# Altium schematic sheet Communication circuit2.SchDoc
size A4
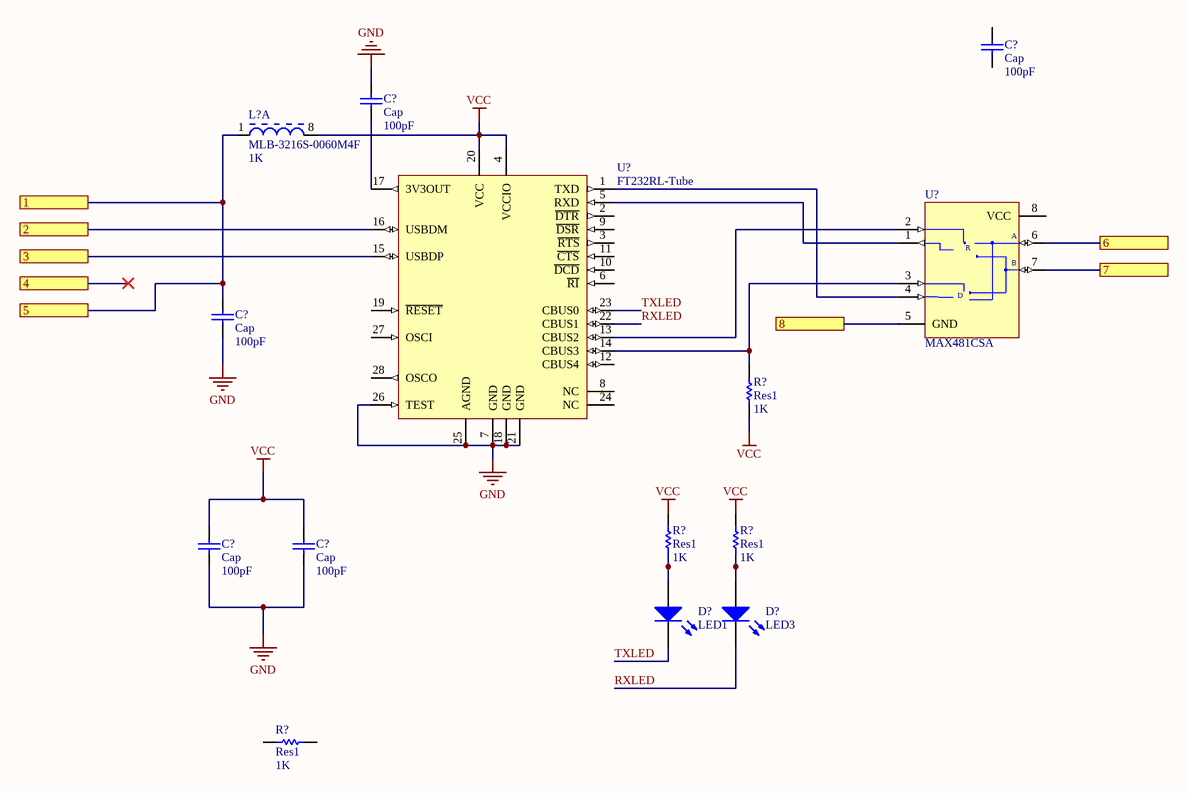
[diagram p0: Communication circuit2.SchDoc]

## Parts
(Parts that share a designator on the sheet are numbered #1, #2 ... from top to bottom, then left to right.)
C?#1  Cap  value 100pF  [RAD-0.3]
C?#2  Cap  value 100pF  [RAD-0.3]
C?#3  Cap  value 100pF  [RAD-0.3]
C?#4  Cap  value 100pF  [RAD-0.3]
C?#5  Cap  value 100pF  [RAD-0.3]
D?#1  LED1  [LED-1]
D?#2  LED3  [3.5X2.8X1.9]
L?  MLB-3216S-0060M4F  value 1K  [0805]  (part A of 4)
R?#1  Res1  value 1K  [AXIAL-0.3]
R?#2  Res1  value 1K  [AXIAL-0.3]
R?#3  Res1  value 1K  [AXIAL-0.3]
R?#4  Res1  value 1K  [AXIAL-0.3]
U?#1  FT232RL-Tube  [SSOP-28_N]
U?#2  MAX481CSA  [NSO8_N]

## Ports
1, 2, 3, 4, 5, 6, 7, 8

## Nets
GND: C?#2.2 C?#3.1 C?#4.1 C?#5.1 U?#1.7(GND) U?#1.18(GND) U?#1.21(GND) U?#1.25(AGND) U?#1.26(TEST)
VCC: C?#4.2 C?#5.2 L?.8 R?#1.2 R?#2.1 R?#3.1 U?#1.4(VCCIO) U?#1.20(VCC)
1: C?#3.2 L?.1 ; port 1, port 5
2: U?#1.16(USBDM) ; port 2
3: U?#1.15(USBDP) ; port 3
6: U?#2.6(A) ; port 6
7: U?#2.7(B) ; port 7
8: U?#2.5(GND) ; port 8
RXLED: D?#2.2(K) U?#1.22(CBUS1)
TXLED: D?#1.2(K) U?#1.23(CBUS0)
NetC?#2_1: C?#2.1 U?#1.17(3V3OUT)
NetD?#1_1: D?#1.1(A) R?#2.2
NetD?#2_1: D?#2.1(A) R?#3.2
NetR?#1_1: R?#1.1 U?#1.14(CBUS3) U?#2.3(DE)
NetU?#1_1: U?#1.1(TXD) U?#2.4(DI)
NetU?#1_5: U?#1.5(RXD) U?#2.1(RO)
NetU?#1_13: U?#1.13(CBUS2) U?#2.2(~{RE})

Not connected (* = marked no-connect by the designer): C?#1 1 2; R?#4 1 2; U?#1 2(~{DTR}) 3(~{RTS}) 6(~{RI}) 8(NC) 9(~{DSR}) 10(~{DCD}) 11(~{CTS}) 12(CBUS4) 19(~{RESET}) 24(NC) 27(OSCI) 28(OSCO); U?#2 8(VCC)

## Notes on the sheet
- (in symbol MAX481CSA) R; D

## Library data of the parts
C?#1-C?#5 = Cap: Capacitor; Published: 8-Jun-2000; LatestRevisionDate: 17-Jul-2002; LatestRevisionNote: Re-released for DXP Platform.; PackageReference: RAD-0.3; Publisher: Altium Limited; PackageDescription: Radial Cap, Thru-Hole; 2 Leads; 0.3 in Pin Spacing
D?#1 = LED1: Typical RED GaAs LED; Published: 8-Jun-2000; LatestRevisionDate: 08-Jul-2005; LatestRevisionNote: Mech Layer 1 removed.; PackageReference: LED-1; Publisher: Altium Limited; PackageDescription: LED; 2 Leads
D?#2 = LED3: Typical BLUE SiC LED; Published: 8-Jun-2000; LatestRevisionDate: 17-Dec-2003; LatestRevisionNote: PCB Footprint replaced.; DatasheetVersion: 16-Apr-2002; PackageVersion: 16-Apr-2002; PackageReference: 3.5X2.8X1.9; Publisher: Altium Limited; PackageDescription: SM LED; 2 C-Bend Leads; Body 3.5 x 2.8 x 1.9 mm, inc leads (LxWxH typ)
L? = MLB-3216S-0060M4F: Ferrite Bead (4x1608 = 3216) SM Chip Array, 8 Leads, 60Ohm, 300mA; PCB_Layout: Complies with manufacturer's recommendation.; Sim Note: Enter the Resistance value into parameter field.; Published: 26-Sep-2008; DatasheetVersion: Mar-2007; PackageVersion: Mar-2007; PackageReference: 321608; Publisher: Altium Limited; PackageDescription: 4-Line Ferrite Bead Chip Array, (1206); SM; 8 Leads; Body 3.2 x 1.5 x 0.8mm (LxWxH typ); ComponentLink1Description: Manufacturer Link; ComponentLink1URL: http://www.kitagawa.de/; ComponentLink2Description: Datasheet; ComponentLink2URL: http://www.kitagawa.de/database/ind/in025027.pdf
R?#1-R?#4 = Res1: Resistor; Published: 8-Jun-2000; LatestRevisionDate: 17-Jul-2002; LatestRevisionNote: Re-released for DXP Platform.; PackageReference: AXIAL-0.3; Publisher: Altium Limited; PackageDescription: Axial Device, Thru-Hole; 2 Leads; 0.3 in Pin Spacing
U?#1 = FT232RL-Tube: USB UART Asynchronous Serial Data Transfer Chip, SSOP-28, Tube; Published: 19-Aug-2010; DatasheetVersion: ver 2.07, Jul-2010; PackageVersion: 2010; PackageReference: SSOP-28; Publisher: Altium Limited; PackageDescription: 28-Pin Small Outline Package 0.65 mm Pitch; ComponentLink1Description: Manufacturer Link; ComponentLink1URL: http://www.ftdichip.com/Products/ICs/FT232R.htm; ComponentLink2Description: Datasheet; ComponentLink2URL: http://www.ftdichip.com/Support/Documents/DataSheets/ICs/DS_FT232R.pdf
U?#2 = MAX481CSA: Low-Power, Slew-Rate-Limited RS-485/RS-422 Transceiver; Published: 16-Jan-2001; LatestRevisionDate: 13-Apr-2006; LatestRevisionNote: IPC-7351 Footprint Added.; DatasheetVersion: Feb-1996; PackageReference: NSO8; Publisher: Altium Limited; PackageDescription: 8-Pin Small Outline Integrated Circuit 1.27 mm Pitch; Code_JEDEC: MS-012-AA; Code_IPC: SOIC127P600-8; ComponentLink1Description: Manufacturer Link; ComponentLink1URL: http://www.maxim-ic.com/; ComponentLink2Description: Datasheet; ComponentLink2URL: http://pdfserv.maxim-ic.com/en/ds/MAX1487-MAX491.pdf